# Altium schematic sheet bqZUM_UsbBtAdapter.SchDoc: USB/BT Adapter
size A4; Author: Raúl de Pablos; CompanyName: bq - Mundo Reader; Organization: bq - Mundo Reader; DocumentNumber: 5; Revision: 2.6; SheetNumber: 5; SheetTotal: 8; ProjectName: ZUM BT328
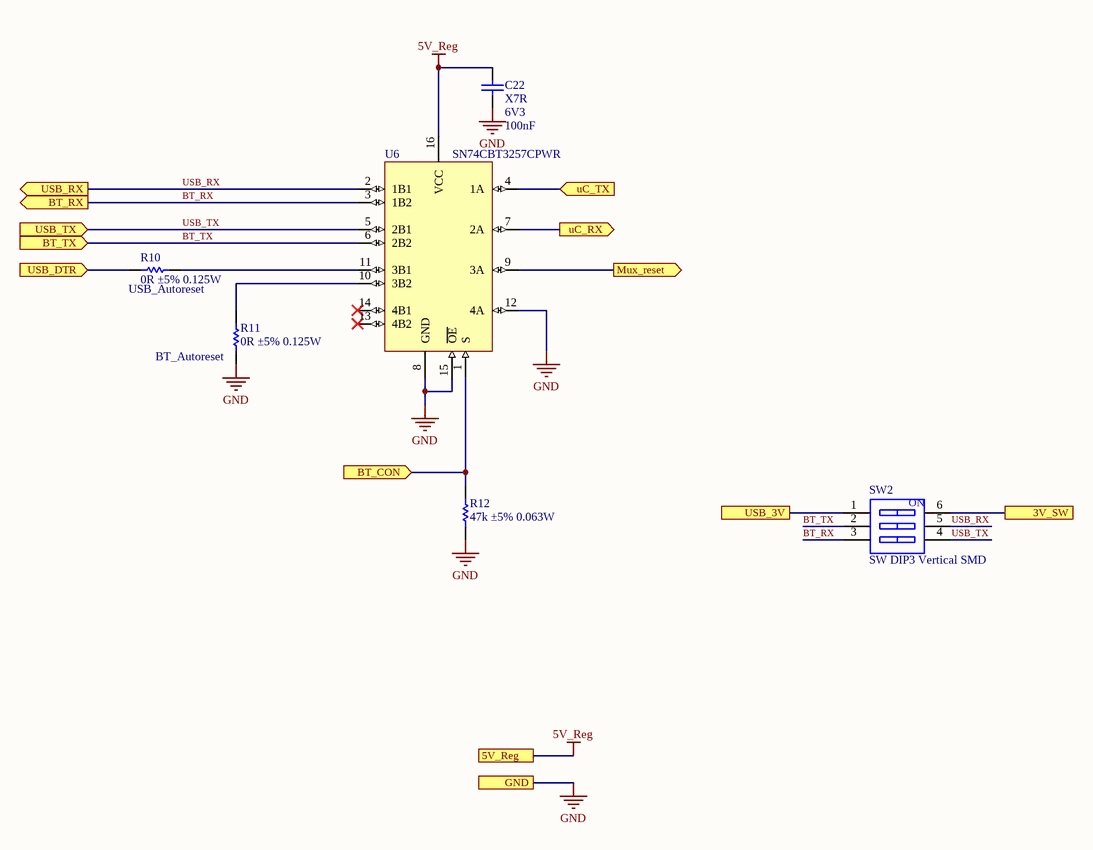
[diagram p0: bqZUM_UsbBtAdapter.SchDoc]

## Parts
C22  Dielectric: X7R  Voltage: 6V3  Capacitance: 100nF  [C0402]  (hidden comment: Capacitor)
R10  value 0R ±5% 0.125W  [R0805]  (hidden comment: Resistor)
R11  value 0R ±5% 0.125W  [R0805]  (hidden comment: Resistor)
R12  value 47k ±5% 0.063W  [R0402]  (hidden comment: Resistor)
SW2  SW DIP3 Vertical SMD  [SW DIP3 SMD 1.27]
U6  SN74CBT3257CPWR  [TSSOP16]

## Ports
3V_SW, 5V_Reg, BT_CON (in), BT_RX (out), BT_TX (in), GND, Mux_reset (out), uC_RX (out), uC_TX (in), USB_3V, USB_DTR (in), USB_RX (out), USB_TX (in)

## Nets
5V_Reg: C22.1 U6.16(VCC) ; port 5V_Reg
GND: C22.2 R11.1 R12.1 U6.8(GND) U6.12(4A) U6.15(~{OE}) ; port GND
3V_SW: SW2.6 ; port 3V_SW
BT_CON: R12.2 U6.1(S) ; port BT_CON
BT_RX: SW2.3 U6.3(1B2) ; port BT_RX
BT_TX: SW2.2 U6.6(2B2) ; port BT_TX
Mux_reset: U6.9(3A) ; port Mux_reset
uC_RX: U6.7(2A) ; port uC_RX
uC_TX: U6.4(1A) ; port uC_TX
USB_3V: SW2.1 ; port USB_3V
USB_DTR: R10.1 ; port USB_DTR
USB_RX: SW2.5 U6.2(1B1) ; port USB_RX
USB_TX: SW2.4 U6.5(2B1) ; port USB_TX
NetR10_2: R10.2 U6.11(3B1)
NetR11_2: R11.2 U6.10(3B2)

Not connected (* = marked no-connect by the designer): U6 13(4B2)* 14(4B1)*

## Notes on the sheet
- (near R10) USB_Autoreset
- (near R11) BT_Autoreset
- Title
- Project
- Size:
- Author
- A4
- Number:
- Revision:
- Mundo Reader, S.L. This project and all the sheets and layouts enclosed are licensed under Creative Commons by Attribution and Share Alike [CC BY-SA] (www.creativecommons.com)
- Date:
- Time:
- Sheet
- of
- (in symbol SW-DIP 3 SMD) ON

## Library data of the parts
C22 = C0402_100nF_6V3_±10%: Manufacturer: Kemet; Value: 100nF ±10% 6V3; Tolerance: ±10%; OrderingCode: C0402C104K9RAC; Temp_ Max: 125; Temp_ Min: -55; Part Number: C0402_100nF_6V3_±10%
R10 R11 = R0805_0R_0.125W_±5%: Manufacturer: Vishay; Tolerance: ±5%; OrderingCode: CRCW08050000Z0; Power: 0.125W; Resistance: 0R; Temp_ Max: 155; Temp_ Min: -55; PackageDescription: SMD; Part Number: R0805_0R_0.125W_±5%
R12 = R0402_47k_0.063W_±5%: Manufacturer: Vishay; Tolerance: ±5%; OrderingCode: CRCW040247K0JN; Power: 0.063W; Resistance: 47k; Temp_ Max: 155; Temp_ Min: -55; PackageDescription: SMD; Part Number: R0402_47k_0.063W_±5%
SW2 = SW-DIP 3 SMD: SWITCH TAPE SEAL 3 POS SMD; Manufacturer: Würth Elektronik; OrderingCode: 416 131 160 803; Temp_ Max: 85; Temp_ Min: -40; Part Number: SW-DIP 3 SMD
U6 = SN74CBT3257: 4-bit 1-of-2 FET multiplexer/demultiplexer; Manufacturer: Texas Instruments; Temp_ Max: 85; Temp_ Min: -40; Part Number: SN74CBT3257; OrderingCode: SN74CBT3257CPWR